# Altium schematic sheet Digital Sensors.SchDoc
size A; SheetNumber: 3; SheetTotal: 5
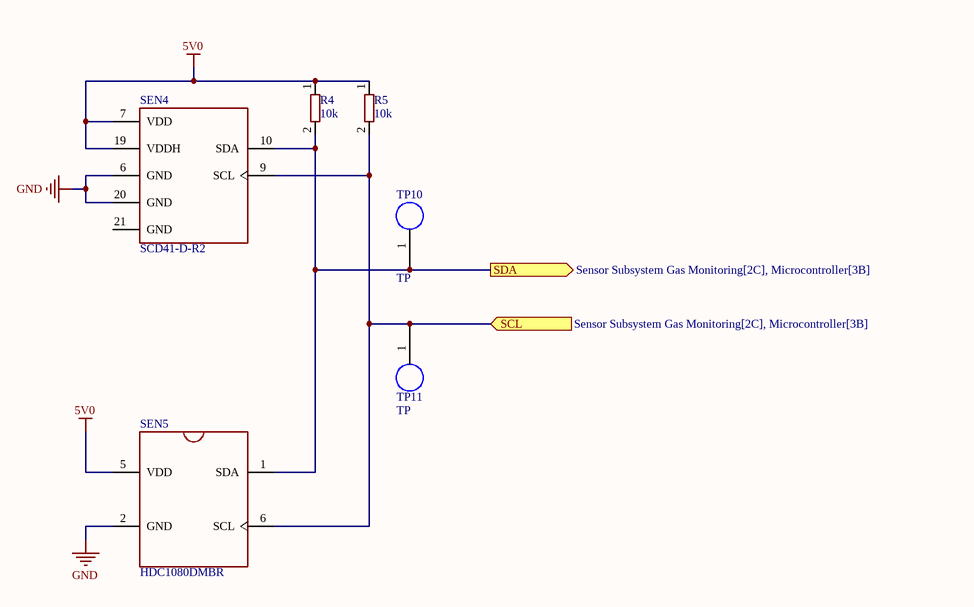
[diagram p0: Digital Sensors.SchDoc]

## Parts
R4  10k  [0603]
R5  10k  [0603]
SEN4  SCD41-D-R2  [XDCR_SCD41-D-R2]
SEN5  HDC1080DMBR  [SON100P300X300X80-7N]
TP10  TP  [TestPoint]  (no BOM)
TP11  TP  [TestPoint]  (no BOM)

## Ports
SCL (in, see Sensor Subsystem Gas Monitoring[2C], Microcontroller[3B]), SDA (out, see Sensor Subsystem Gas Monitoring[2C], Microcontroller[3B])

## Nets
5V0: R4.1 R5.1 SEN4.7(VDD) SEN4.19(VDDH) SEN5.5(VDD)
GND: SEN4.6(GND) SEN4.20(GND) SEN5.2(GND)
SCL: R5.2 SEN4.9(SCL) SEN5.6(SCL) TP11.1 ; port SCL
SDA: R4.2 SEN4.10(SDA) SEN5.1(SDA) TP10.1 ; port SDA

Not connected (* = marked no-connect by the designer): SEN4 21(GND)

## Library data of the parts
R4 R5 = RC0603FR-1310KL: http://octopart.com/rc0603fr-1310kl-yageo+%2F+phycomp-25905087; Package: None; Price: None; Value: *; MP: RC0603FR-1310KL; Availability: Unavailable
SEN4 = SCD41-D-R2: Air Quality Sensor CO2 Sensor 2.5V/3.3V/5V 20-Pin SMD EP; MF: Sensirion AG; SnapEDA_Link: https://www.snapeda.com/parts/SCD41-D-R2/Sensirion+AG/view-part/?ref=snap; Availability: In Stock; MP: SCD41-D-R2; Price: None; Purchase-URL: https://pricing.snapeda.com/search/part/SCD41-D-R2/?ref=eda; Package: None; Check_prices: https://www.snapeda.com/parts/SCD41-D-R2/Sensirion+AG/view-part/?ref=eda; Value: *
SEN5 = HDC1080DMBR: Temperature and Humidity Sensor; MF: Texas Instruments; Price: None; Availability: Unavailable; SnapEDA_Link: https://www.snapeda.com/parts/HDC1080DMBR/Texas%20Instruments/view-part/472819/?ref=snap; Value: *; MP: HDC1080DMBR; Package: WSON-6 Texas Instruments; Purchase-URL: https://pricing.snapeda.com/search/part/HDC1080DMBR/?ref=eda
TP10 TP11 = TestPoint: Test point for voltage, current, ect.